# Altium schematic sheet humanidiot PCB.SchDoc
size A; SheetNumber: 1; SheetTotal: 1
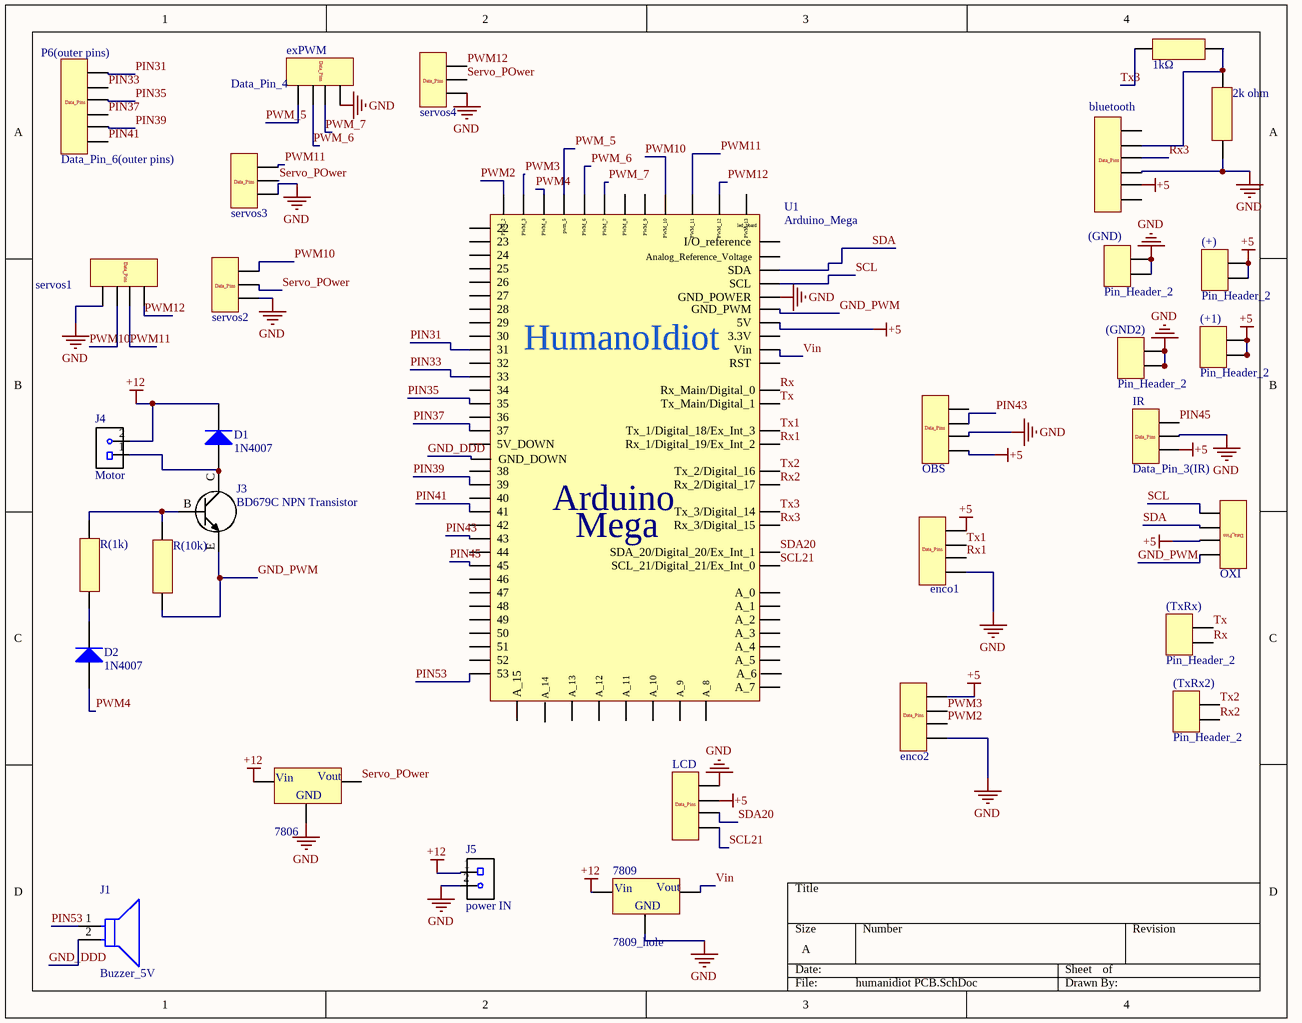
[diagram p0: humanidiot PCB.SchDoc]

## Parts
1kΩ  0.25W_resistor  [0.25W_resistor]  (value not drawn)
2k_ohm  0.25W_resistor  [0.25W_resistor]  (value not drawn)
7809  7809_hole  [780X_hole]
(+1)  Pin_Header_2  [pin header_2]
(+)  Pin_Header_2  [pin header_2]
(GND2)  Pin_Header_2  [pin header_2]
(GND)  Pin_Header_2  [pin header_2]
(TxRx2)  Pin_Header_2  [pin header_2]
(TxRx)  Pin_Header_2  [pin header_2]
blu  bluetooth  [Data_Pin_6]
D1  1N4007  [FAIR-DO-41-2]
D2  1N4007  [FAIR-DO-41-2]
enco1  enco1  [Data_Pin_4]
enco2  enco2  [Data_Pin_4]
exPWM  Data_Pin_4  [Data_Pin_4]
IR  Data_Pin_3(IR)  [Data_Pin_3]
J1  Buzzer_5V  [Buzzer_5V_14mm]
J2  7806  [780X_hole]
J3  BD679C NPN Transistor  [BD679C NPN Transistor]
J4  Motor  [Screw Terminal 2 pins]
J5  power IN  [Screw Terminal 2 pins]
LCD  LCD  [Data_Pin_4]  (value not drawn)
obs  OBS  [Data_Pin_4]
oxi  OXI  [Data_Pin_4]
P1  servos2  [Data_Pin_3]
P2  servos3  [Data_Pin_3]
P3  servos4  [Data_Pin_3]
P6(outer_pins)  Data_Pin_6(outer pins)  [Data_Pin_6]
R(1k)  0.25W_resistor  [0.25W_resistor]  (value not drawn)
R(10k)  0.25W_resistor  [0.25W_resistor]  (value not drawn)
servos  servos1  [Data_Pin_4]
U1  Arduino_Mega  [Arduino_Mega]

## Nets
+5: (+1).38 (+1).39 (+).38 (+).39 blu.5 enco1.1 enco2.1 IR.3 LCD.2 obs.4 oxi.2 U1.5V
+12: 7809.1 D1.1(K) J2.1 J4.2 J5.1
GND: 2k_ohm.1 7809.3 (GND2).38 (GND2).39 (GND).38 (GND).39 blu.4 enco1.4 enco2.4 exPWM.1 IR.2 J2.3 J5.2 LCD.1 obs.3 P1.3 P2.3 P3.3 servos.4 U1.GND_POWER
GND_DDD: J1.2 U1.GND_DOWN
GND_PWM: J3.E oxi.1 R(10k).2 U1.GND_PWM
PIN31: P6(outer_pins).1 U1.31
PIN33: P6(outer_pins).2 U1.33
PIN35: P6(outer_pins).3 U1.35
PIN37: P6(outer_pins).4 U1.37
PIN39: P6(outer_pins).5 U1.39
PIN41: P6(outer_pins).6 U1.41
PIN43: obs.2 U1.43
PIN45: IR.1 U1.45
PIN53: J1.1 U1.53
PWM2: enco2.3 U1.PWM_2
PWM3: enco2.2 U1.PWM_3
PWM4: D2.2(A) U1.PWM_4
PWM10: P1.1 servos.3 U1.PWM_10
PWM11: P2.1 servos.2 U1.PWM_11
PWM12: P3.1 servos.1 U1.PWM_12
PWM_5: exPWM.4 U1.PWM_5(pwm_5)
PWM_6: exPWM.3 U1.PWM_6
PWM_7: exPWM.2 U1.PWM_7
Rx: (TxRx).39 U1.Rx_0(Rx_Main/Digital_0)
Rx1: enco1.3 U1.Rx_19(Rx_1/Digital_19/Ex_Int_2)
Rx2: (TxRx2).39 U1.Rx_17(Rx_2/Digital_17)
Rx3: blu.3 U1.Rx_15(Rx_3/Digital_15)
SCL: oxi.4 U1.SCL
SCL21: LCD.4 U1.SCL_21(SCL_21/Digital_21/Ex_Int_0)
SDA: oxi.3 U1.SDA
SDA20: LCD.3 U1.SDA_20(SDA_20/Digital_20/Ex_Int_1)
Servo_POwer: J2.2 P1.2 P2.2 P3.2
Tx: (TxRx).38 U1.Tx_1(Tx_Main/Digital_1)
Tx1: enco1.2 U1.Tx_18(Tx_1/Digital_18/Ex_Int_3)
Tx2: (TxRx2).38 U1.Tx_16(Tx_2/Digital_16)
Tx3: 1kΩ.2 U1.Tx_14(Tx_3/Digital_14)
Vin: 7809.2 U1.Vin
Net1kΩ_1: 1kΩ.1 2k_ohm.2 blu.2
NetD1_2: D1.2(A) J3.C J4.1
NetD2_1: D2.1(K) R(1k).2
NetJ3_B: J3.B R(1k).1 R(10k).1

Not connected (* = marked no-connect by the designer): blu 1 6; obs 1; U1 3.3V 5V_DOWN 22 23 24 25 26 27 28 29 30 32 34 36 38 40 42 44 46 47 48 49 50 51 52 A_0 A_1 A_2 A_3 A_4 A_5 A_6 A_7 A_8 A_9 A_10 A_11 A_12 A_13 A_14 A_15 PWM_8 PWM_9 PWM_13 REF(Analog_Reference_Voltage) REF_I/O(I/O_reference) RST

## Notes on the sheet
- (in symbol 7805_hole) Vout; Vin; GND
- (in symbol 7809_hole) Vin; Vout; GND
- (in symbol Arduino_Mega) led_board; HumanoIdiot; Arduino; Mega
- (in symbol CMP-010-000008-1) Data_Pins
- (in symbol Data_Pin_3) Data_Pins
- (in symbol Data_Pin_4) Data_Pins
- (in symbol Data_Pin_6) Data_Pins

## Library data of the parts
(+1) (+) (GND2) (GND) (TxRx2) (TxRx) = Pin_Header_2: pin header
blu P6(outer_pins) = Data_Pin_6
D1 D2 = CMP-004-00007-2: General Purpose Rectifier, 1.1 V, 1.0 A, -55 to 175 degC, 2-Pin DO-41, RoHS, Tape and Reel; Manufacturer: Fairchild; Peak Reverse Current: 5uA; Max Surge Current: 30A; Elements: 1; Forward Voltage: 1.1V; Package Version: Rev. 2, 09/2008; Forward Current: 1A; Package Quantity: 5000; Packaging: TapeandReel; Package URL: http://www.fairchildsemi.com/dwg/DO/DO41A.pdf; Manufacturer URL: https://www.fairchildsemi.com/; Package Reference: DO-41-2; Pins: 2; Min Operating Temperature: -55°C; Datasheet Version: Rev. 1.1.0, 11/2014; Max Operating Temperature: 175°C; RoHS Compliant: True; Case/Package: DO-41-2; Mounting Technology: TH; Package Description: 2-Pin Axial Lead, Dia 2.375 mm, Body Length 4.63 mm; Datasheet URL: https://www.fairchildsemi.com/datasheets/1N/1N4007.pdf
enco1 enco2 LCD obs oxi = Data_Pin_4
exPWM servos = CMP-010-000008-1: Source: negm_library.SchLib; Design Item ID: Data_Pin_4
IR P1-P3 = Data_Pin_3
J2 = 7805_hole
J3 = BD679C NPN Transistor: BD679C 750@1.5A,3V 80V NPN 4A 40W TO-126-3 Darlington Transistor
J4 J5 = Screw Terminal 2 pins: Brass Alloy 1x2P 16A -40℃~+105℃ 300V Blue Tin 12~24 Direct Insert 5.08mm 1 2 Plugin,P=5.08mm Screw Terminal Blocks ROHS; Manufacturer: CUI; Manufacturer Part Number: TB004-508-02BE; Supplier: LSCS ELECTRONICS; Supplier Part Number: C3818636